# Altium schematic sheet Sheet1.SchDoc
size A4; SheetNumber: 1; SheetTotal: 1
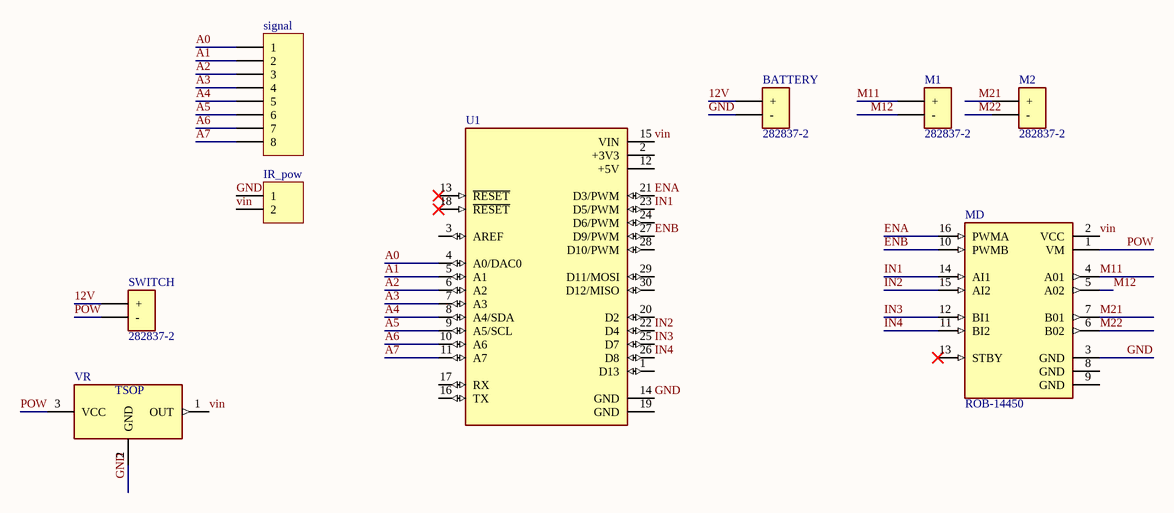
[diagram p0: Sheet1.SchDoc]

## Parts
BATTERY  282837-2  [TE_282837-2]
IR_pow  Header 2  [HDR1X2]  (value not drawn)
M1  282837-2  [TE_282837-2]
M2  282837-2  [TE_282837-2]
MD  ROB-14450  [MODULE_ROB-14450]
signal  Header 8  [HDR1X8]  (value not drawn)
SWITCH  282837-2  [TE_282837-2]
U1  ABX00028  [MODULE_ABX00028]  (value not drawn)
VR  TSOP1838  [TSOP1838]  (value not drawn)

## Nets
12V: BATTERY.1(+) SWITCH.1(+)
A0: signal.1 U1.4(A0/DAC0)
A1: signal.2 U1.5(A1)
A2: signal.3 U1.6(A2)
A3: signal.4 U1.7(A3)
A4: signal.5 U1.8(A4/SDA)
A5: signal.6 U1.9(A5/SCL)
A6: signal.7 U1.10(A6)
A7: signal.8 U1.11(A7)
ENA: MD.16(PWMA) U1.21(D3/PWM)
ENB: MD.10(PWMB) U1.27(D9/PWM)
GND: BATTERY.2(-) IR_pow.1 MD.3(GND) U1.14(GND) VR.2(GND)
IN1: MD.14(AI1) U1.23(D5/PWM)
IN2: MD.15(AI2) U1.22(D4)
IN3: MD.12(BI1) U1.25(D7)
IN4: MD.11(BI2) U1.26(D8)
M11: M1.1(+) MD.4(A01)
M12: M1.2(-) MD.5(A02)
M21: M2.1(+) MD.7(B01)
M22: M2.2(-) MD.6(B02)
POW: MD.1(VM) SWITCH.2(-) VR.3(VCC)
vin: IR_pow.2 MD.2(VCC) U1.15(VIN) VR.1(OUT)

Not connected (* = marked no-connect by the designer): MD 8(GND) 9(GND) 13(STBY)*; U1 1(D13) 2(+3V3) 3(AREF) 12(+5V) 13(~{RESET})* 16(TX) 17(RX) 18(~{RESET})* 19(GND) 20(D2) 24(D6/PWM) 28(D10/PWM) 29(D11/MOSI) 30(D12/MISO)

## Notes on the sheet
- (in symbol TSOP1838) TSOP

## Library data of the parts
BATTERY M1 M2 SWITCH = 282837-2: Ð Ð°Ð·ÑŠÐµÐ¼Ð½Ñ‹Ðµ ÐºÐ»ÐµÐ¼Ð¼Ð½Ñ‹Ðµ ÐºÐ¾Ð»Ð¾Ð´ÐºÐ¸ Ð Ð¾Ð·ÐµÑ‚ÐºÐ° 2 Ð¿Ð¾Ð»Ð¾Ð¶ÐµÐ½Ð¸Ñ 5,08 Ð¼Ð¼ ÐŸÑ€Ð¸Ð¿Ð¾Ð¹ Ð¿Ñ€ÑÐ¼Ð¾Ð¹ Ñ‡ÐµÑ€ÐµÐ· Ð¾Ñ‚Ð²ÐµÑ€ÑÑ‚Ð¸Ðµ 13,5 Ð / ÐºÐ¾Ð½Ñ‚Ð°ÐºÑ‚; MF: TE Connectivity; SnapEDA_Link: https://www.snapeda.com/parts/282837-2/TE+Connectivity+AMP+Connectors/view-part/?ref=snap; Price: None; Check_prices: https://www.snapeda.com/parts/282837-2/TE+Connectivity+AMP+Connectors/view-part/?ref=eda; Purchase-URL: https://pricing.snapeda.com/search/part/282837-2/?ref=eda; MP: 282837-2; Value: *; Availability: In Stock; Package: None
IR_pow = Header 2: Header, 2-Pin; LatestRevisionDate: 17-Jul-2002; LatestRevisionNote: Re-released for DXP Platform.; Publisher: Altium Limited
MD = ROB-14450: TB6612FNG Motor Controller/Driver Power Management Evaluation Board; MF: SparkFun Electronics; Check_prices: https://www.snapeda.com/parts/ROB-14450/SparkFun%20Electronics/view-part/2656367/?ref=eda; Package: None; MP: ROB-14450; Value: *; Availability: In Stock; SnapEDA_Link: https://www.snapeda.com/parts/ROB-14450/SparkFun%20Electronics/view-part/2656367/?ref=snap; Price: None
signal = Header 8: Header, 8-Pin; LatestRevisionDate: 17-Jul-2002; LatestRevisionNote: Re-released for DXP Platform.; Publisher: Altium Limited
U1 = ABX00028: Arduinoâ€™s 5V compatible board in the smallest available form factor: 45x18mm!; MP: Arduino Nano Every; Check_prices: https://www.snapeda.com/parts/Arduino%20Nano%20Every/Arduino/view-part/?ref=eda; Value: *; Availability: Not in stock; Price: None; Package: None; SnapEDA_Link: https://www.snapeda.com/parts/Arduino%20Nano%20Every/Arduino/view-part/?ref=snap; MF: Arduino
VR = TSOP1838: IR Remote Receiver 38KHz 35m 3-Pin; MF: Vishay; SnapEDA_Link: https://www.snapeda.com/parts/TSOP1838/Vishay/view-part/?ref=snap; Package: None; Value: *; MP: TSOP1838; Check_prices: https://www.snapeda.com/parts/TSOP1838/Vishay/view-part/?ref=eda